# Altium schematic sheet Knot_Thing_USB_Power.SchDoc: KNoT Thing DevBoard USB Power
size A4; Organization: C.E.S.A.R; Address1: Rua Bione, 220; Address2: Bairro do Recife; Address3: Recife - PE - Brasil; Address4: 50030-390; DocumentNumber: 1; Revision: 1; SheetNumber: 1; SheetTotal: 3
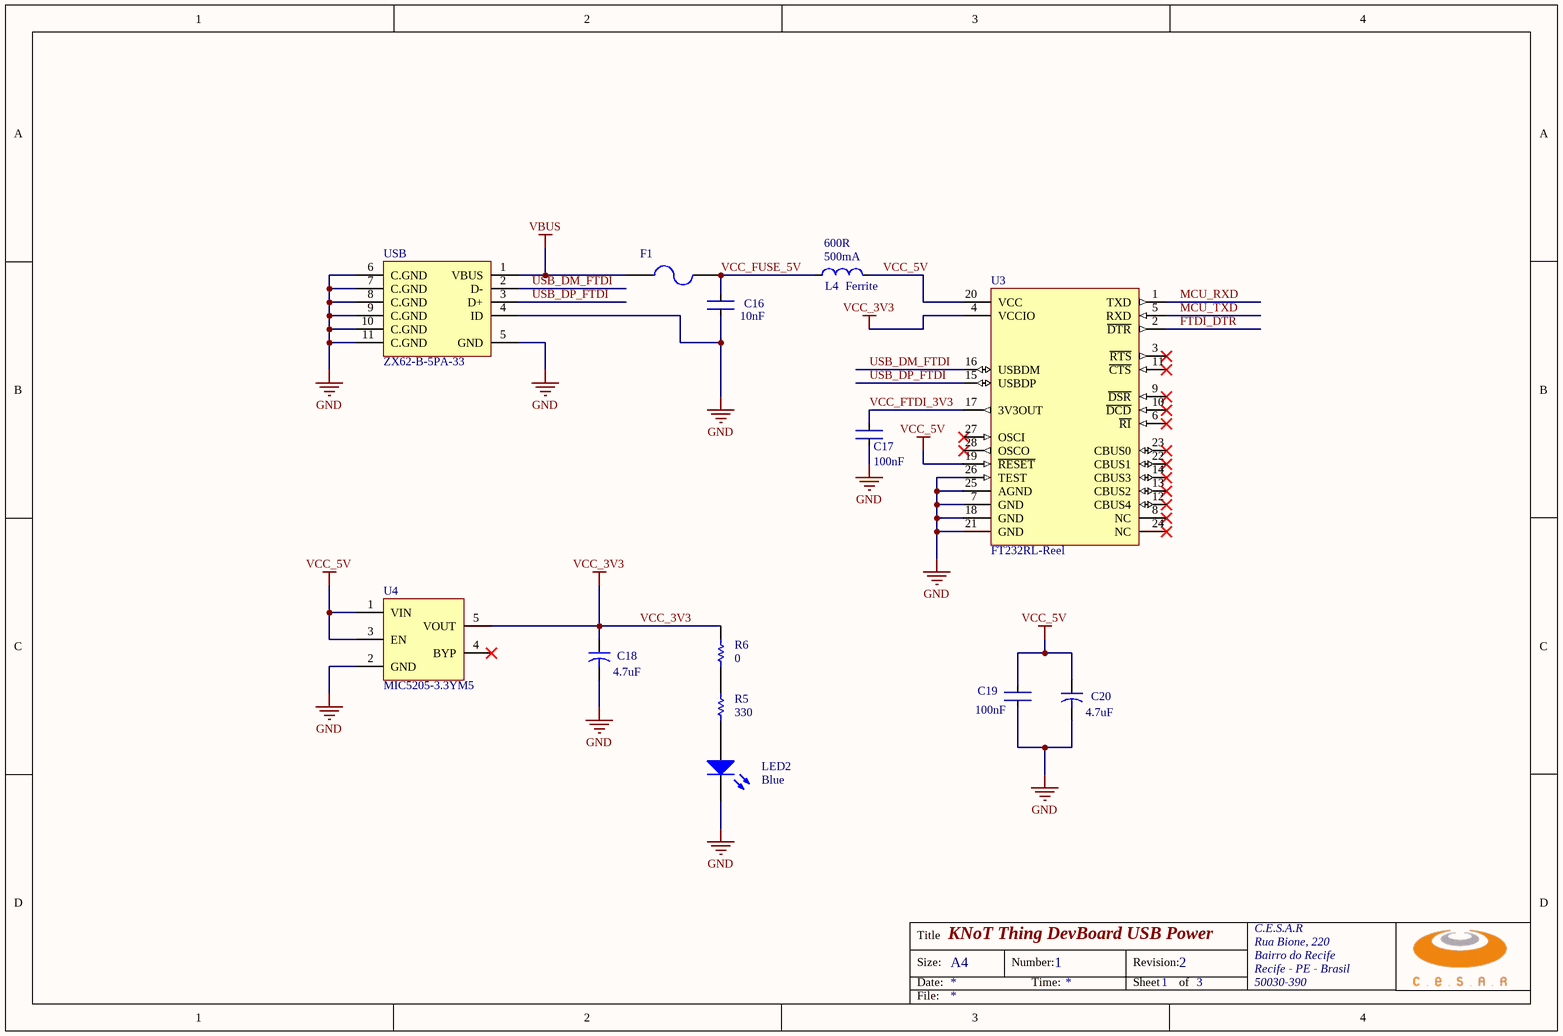
[diagram p0: Knot_Thing_USB_Power.SchDoc]

## Parts
C16  value 10nF  [CAPC1005L]  (hidden comment: Cap_0402)
C17  value 100nF  [CAPC1005L]  (hidden comment: Cap_0402)
C18  value 4.7uF  [CAPC1608L]  (hidden comment: Cap0603)
C19  value 100nF  [CAPC1005L]  (hidden comment: Cap_0402)
C20  value 4.7uF  [CAPC1608L]  (hidden comment: Cap0603)
F1  0402L050SLKR  [0805L]  (value not drawn)
L4  Ferrite  Res: 600R  Cur: 500mA  [0603-cap]
LED2  Color: Blue  [0603_LED]  (hidden comment: LED 0603)
R5  value 330  [CAPC1005L]  (hidden comment: RES_0402)
R6  value 0  [CAPC1005L]  (hidden comment: RES_0402)
U3  FT232RL-Reel  [SSOP-28_N]
U4  MIC5205-3.3YM5  [SOT23-5]
USB  ZX62-B-5PA-33  [Micro USB b]

## Nets
GND: C16.1 C17.2 C18.2 C19.2 C20.2 LED2.2(K) U3.7(GND) U3.18(GND) U3.21(GND) U3.25(AGND) U3.26(TEST) U4.2(GND) USB.4(ID) USB.5(GND) USB.6(C.GND) USB.7(C.GND) USB.8(C.GND) USB.9(C.GND) USB.10(C.GND) USB.11(C.GND)
VBUS: F1.1 USB.1(VBUS)
VCC_3V3: C18.1 R6.2 U3.4(VCCIO) U4.5(VOUT)
VCC_5V: C19.1 C20.1 L4.2 U3.19(~{RESET}) U3.20(VCC) U4.1(VIN) U4.3(EN)
FTDI_DTR: U3.2(~{DTR})
MCU_RXD: U3.1(TXD)
MCU_TXD: U3.5(RXD)
USB_DM_FTDI: U3.16(USBDM) USB.2(D-)
USB_DP_FTDI: U3.15(USBDP) USB.3(D+)
VCC_FTDI_3V3: C17.1 U3.17(3V3OUT)
VCC_FUSE_5V: C16.2 F1.2 L4.1
NetLED2_1: LED2.1(A) R5.1
NetR5_2: R5.2 R6.1

Not connected (* = marked no-connect by the designer): U3 3(~{RTS})* 6(~{RI})* 8(NC)* 9(~{DSR})* 10(~{DCD})* 11(~{CTS})* 12(CBUS4)* 13(CBUS2)* 14(CBUS3)* 22(CBUS1)* 23(CBUS0)* 24(NC)* 27(OSCI)* 28(OSCO)*; U4 4(BYP)*

## Notes on the sheet
- Title
- Size:
- Date:
- A4
- Number:
- Time:
- Revision:
- Sheet
- 2
- of
- File:

## Library data of the parts
C16 C17 C19 = Capacitor_0402: Chip Capacitor 0402 (1005 metric); Supplier 1: Digi-Key
  C16: Supplier Part Number 1: 311-1703-1-ND
  C17 C19: Supplier Part Number 1: 311-1731-1-ND
C18 C20 = Cap0603: 4.7µF 10V Ceramic Capacitor X5R 0603; Published: 23-Sep-2002; Publisher: Altium Limited; PackageDescription: Capacitor; 2 Leads; Supplier 1: Digi-Key; Supplier Part Number 1: 311-1453-1-ND
F1 = Fuse 2: PTC Resettable Fuse 6V 500mA Ih Surface Mount 0402 (1005 Metric), Concave; Supplier 1: Digi-Key; Supplier Part Number 1: F2772CT-ND
L4 = Ferrite: BLM18AG121SN1 FERRITE 120 OHM 500MA 0603; Supplier 1: Digi-Key; Supplier Part Number 1: 445-2166-1-ND
LED2 = LED 0603: LED SMD 0603; Supplier 1: Digi-Key; Supplier Part Number 1: 754-1789-1-ND
R5 R6 = RES_0402: Precision Thick Film Chip Resistor, 10 Ohm to 1M Ohm Range, 1% and 0.5% Tolerance, 0805 Size, 1/8 W; Supplier 1: Digi-Key
  R5: Supplier Part Number 1: 311-330JRCT-ND
  R6: Supplier Part Number 1: 311-0.0JRTR-ND
U3 = FT232RL-Reel: USB UART Asynchronous Serial Data Transfer Chip, 28-pin SSOP, Tape and Reel; Manufacturer: FTDI; DatasheetVersion: ver 2.10, Mar-2012; PackageVersion: Mar-12; PackageReference: SSOP-28; PackageDescription: 28-Pin Small Outline Package 0.65 mm Pitch; PartNumber: FT232RL-Reel; ComponentLink1Description: Manufacturer URL; ComponentLink1URL: http://www.ftdichip.com/; ComponentLink2Description: Datasheet; ComponentLink2URL: http://www.ftdichip.com/Support/Documents/DataSheets/ICs/DS_FT232R.pdf; Supplier 1: Digi-Key; Supplier Part Number 1: 768-1007-6-ND
U4 = MIC5205-3.3YM5: Voltage Regulator; Supplier 1: Digi-Key; Supplier Part Number 1: 576-1259-1-ND
USB = ZX62-B-5PA-33: USB Connector; Supplier 1: Digi-Key; Supplier Part Number 1: H125270CT-ND